# EAGLE design Tesla Camera PCB version 1 (EAGLE 6.5.0)
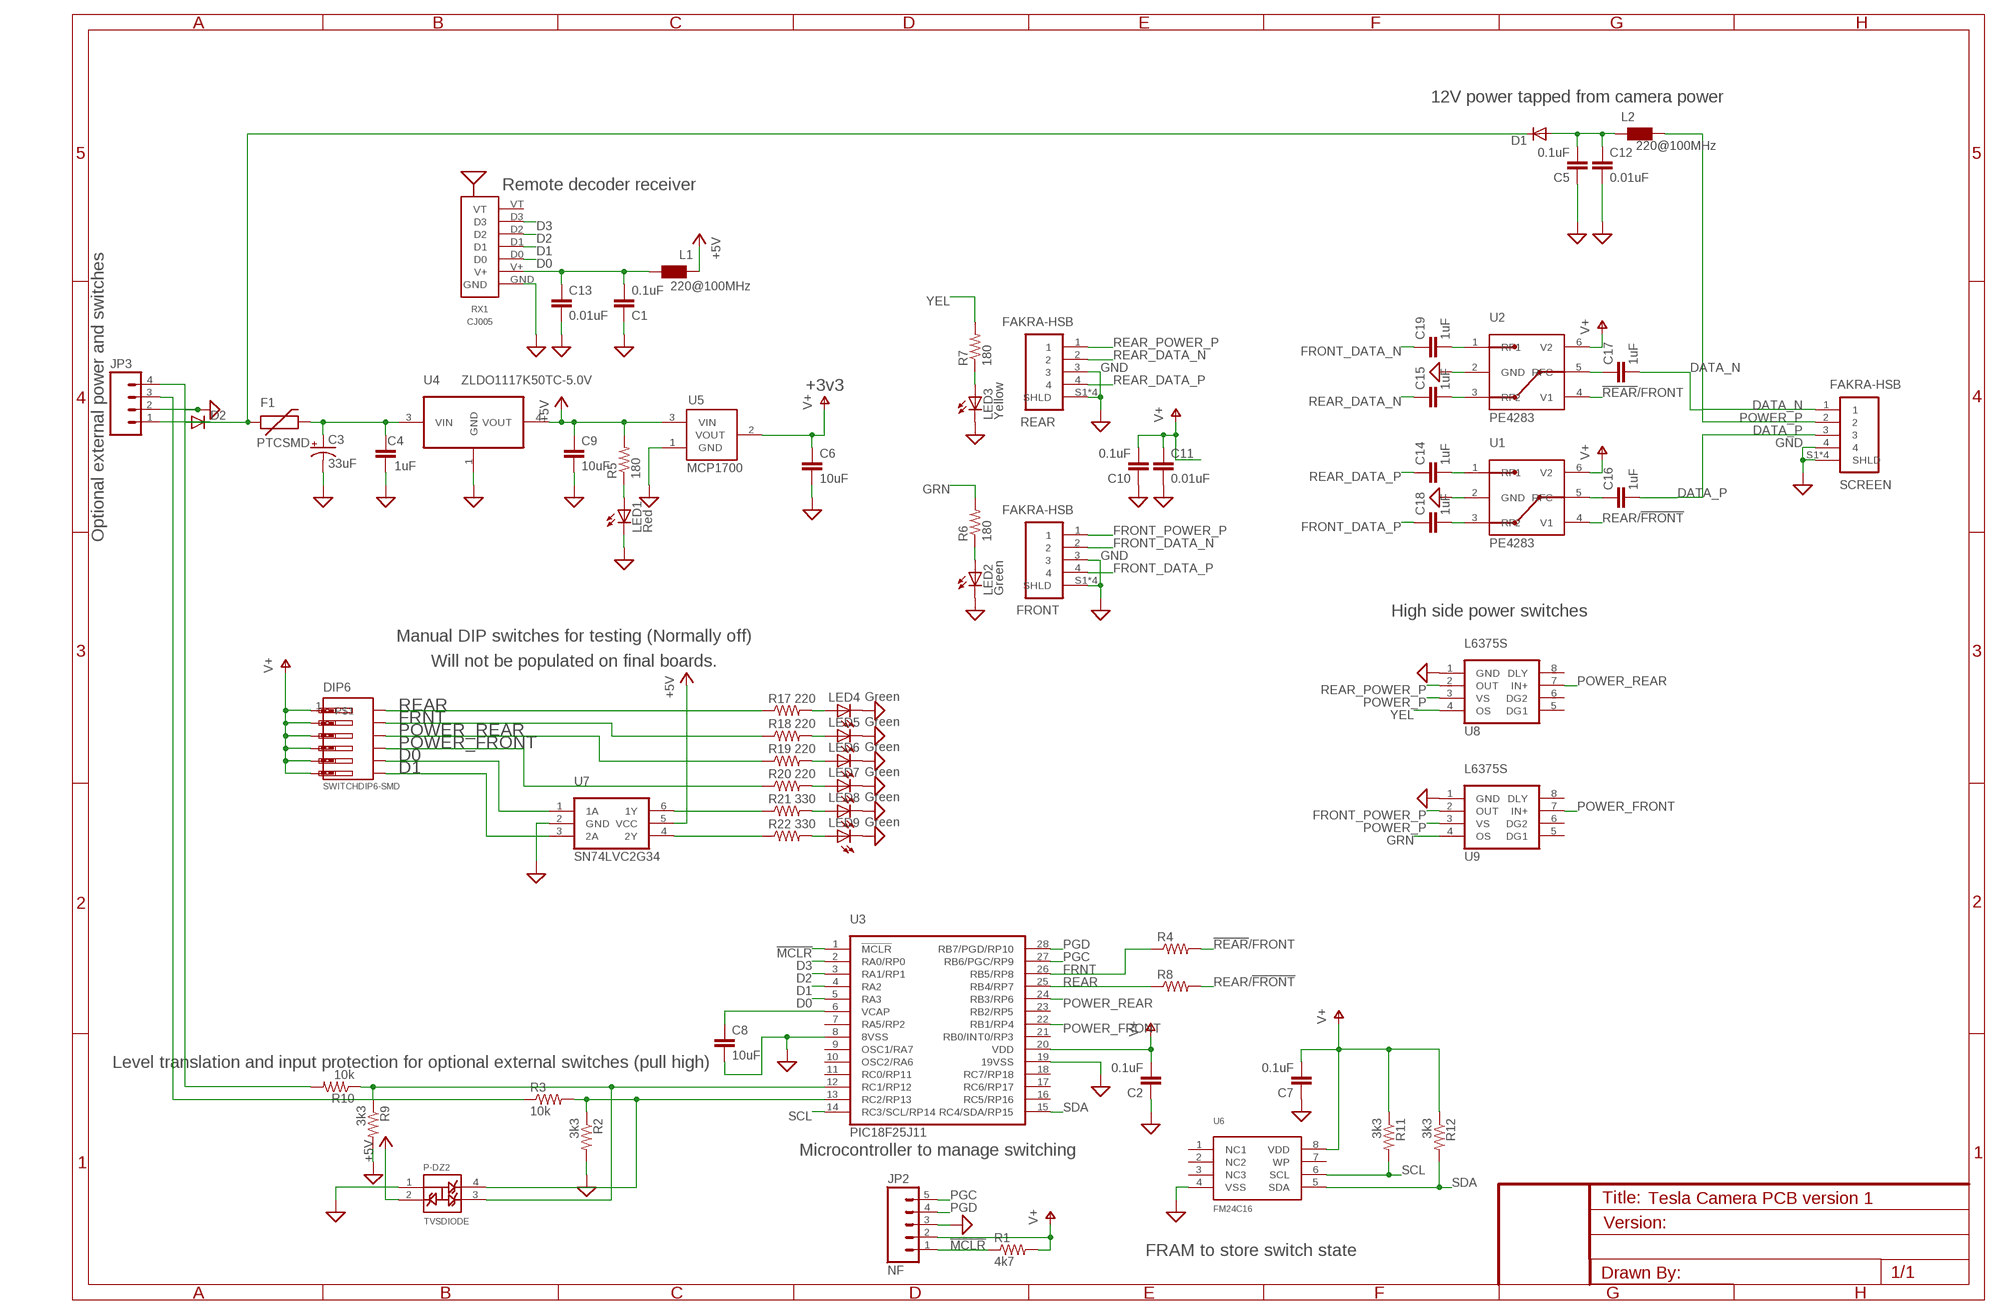
[diagram p0: schematic, sheet 1]

## Parts
C1  0.1uF  CAP0805  [0805]
C2  0.1uF  CAP0805  [0805]
C3  33uF  CAP_POLVTYPE  [CAPVTYPE]
C4  1uF  CAP0805  [0805]
C5  0.1uF  CAP0805  [0805]
C6  10uF  CAP0805  [0805]
C7  0.1uF  CAP0805  [0805]
C8  10uF  CAP0805  [0805]
C9  10uF  CAP0805  [0805]
C10  0.1uF  CAP0805  [0805]
C11  0.01uF  CAP0805  [0805]
C12  0.01uF  CAP0805  [0805]
C13  0.01uF  CAP0805  [0805]
C14  1uF  CAP0603-CAP  [0603-CAP]
C15  1uF  CAP0603-CAP  [0603-CAP]
C16  1uF  CAP0603-CAP  [0603-CAP]
C17  1uF  CAP0603-CAP  [0603-CAP]
C18  1uF  CAP0603-CAP  [0603-CAP]
C19  1uF  CAP0603-CAP  [0603-CAP]
D1  DIODE-DO-214AC  [DO-214AC]
D2  DIODE-DO-214AC  [DO-214AC]
DIP6  SWITCHDIP6-SMD  [SWITCHDIP6]
F1  PTCSMD  [PTC-1206]
FRONT  FAKRA-HSB  [FAKRA]
JP2  NF  M05LOCK  [1X05_LOCK]
JP3  M04-LOCK  [1X04_TERM_3.5MM]
L1  220@100MHz  WE-CBF_0805  [0805]
L2  220@100MHz  WE-CBF_0805  [0805]
LED1  Red  LEDLED  [0805_LED]
LED2  Green  LEDLED  [0805_LED]
LED3  Yellow  LEDLED  [0805_LED]
LED4  Green  LEDLED  [0805_LED]
LED5  Green  LEDLED  [0805_LED]
LED6  Green  LEDLED  [0805_LED]
LED7  Green  LEDLED  [0805_LED]
LED8  Green  LEDLED  [0805_LED]
LED9  Green  LEDLED  [0805_LED]
P-DZ2  TVSDIODE  [SOT143]
R1  4k7  RESISTOR  [0805]
R2  3k3  RESISTOR  [0805]
R3  10k  RESISTOR  [0805]
R4  RESISTOR  [0805]
R5  180  RESISTOR  [0805]
R6  180  RESISTOR  [0805]
R7  180  RESISTOR  [0805]
R8  RESISTOR  [0805]
R9  3k3  RESISTOR  [0805]
R10  10k  RESISTOR  [0805]
R11  3k3  RESISTOR  [0805]
R12  3k3  RESISTOR  [0805]
R17  220  RESISTOR  [0805]
R18  220  RESISTOR  [0805]
R19  220  RESISTOR  [0805]
R20  220  RESISTOR  [0805]
R21  330  RESISTOR  [0805]
R22  330  RESISTOR  [0805]
REAR  FAKRA-HSB  [FAKRA]
RX1  CJ005  [CJ005]
SCREEN  FAKRA-HSB  [FAKRA]
U1  PE4283  [SC70-6]
U2  PE4283  [SC70-6]
U3  PIC18F25J11  PIC18F46J11-SOIC  [SOIC-28-WIDE]
U4  ZLDO1117K50TC-5.0V  ZLDO1117K33TC-3.3V  [TO252]
U5  MCP1700  MCP1700SOT23-3  [SOT23-3]
U6  FM24C16  FM24C16-CYPRESS4.0X4.5MM  [TDFN-8-FRAM]
U7  SN74LVC2G34  [SOT23-6]
U8  L6375S  [SO08-EIAJ]
U9  L6375S  [SO08-EIAJ]

## Nets
!MCLR [Normal]: JP2.1 R1.1 U3.1(!MCLR)
!REAR!/FRONT: R4.2 U2.4(V1)
+5V: C9.1 L1.1 P-DZ2.2 R5.2 U4.4(VOUT) U5.3(VIN) U7.5(VCC)
D0 [Normal]: DIP6.8 RX1.D0 U3.5(RA3) U7.1(1A)
D1 [Normal]: DIP6.7 RX1.D1 U3.4(RA2) U7.3(2A)
D2 [Normal]: RX1.D2 U3.3(RA1/RP1)
D3 [Normal]: RX1.D3 U3.2(RA0/RP0)
DATA_N [Normal]: C17.2 SCREEN.1
DATA_P [Normal]: C16.2 SCREEN.3
FRNT [Normal]: DIP6.11 R4.1 R18.1 U3.26(RB5/RP8)
FRONT_DATA_N [Normal]: C19.1 FRONT.2
FRONT_DATA_P [Normal]: C18.1 FRONT.4
FRONT_POWER_P: FRONT.1 U9.2(OUT)
GND: C1.1 C2.1 C3.- C4.2 C5.1 C6.2 C7.1 C8.2 C9.2 C10.1 C11.2 C12.2 C13.2 FRONT.3 FRONT.S1(SHLD) FRONT.S2(SHLD) FRONT.S3(SHLD) FRONT.S4(SHLD) JP2.3 JP3.2 LED1.C LED2.C LED3.C LED4.C LED5.C LED6.C LED7.C LED8.C LED9.C P-DZ2.1 R2.2 R9.2 REAR.3 REAR.S1(SHLD) REAR.S2(SHLD) REAR.S3(SHLD) REAR.S4(SHLD) RX1.GND SCREEN.4 SCREEN.S1(SHLD) SCREEN.S2(SHLD) SCREEN.S3(SHLD) SCREEN.S4(SHLD) U1.2(GND) U2.2(GND) U3.8(8VSS) U3.19(19VSS) U4.1(GND) U5.1(GND) U6.4(VSS) U7.2(GND) U8.1(GND) U9.1(GND)
GRN [Normal]: R6.2 U9.4(OS)
N$1: C5.2 C12.1 D1.A L2.1
N$2 [Normal]: P-DZ2.3 R9.1 R10.1 U3.12(RC1/RP12)
N$3 [Normal]: LED2.A R6.1
N$4 [Normal]: JP3.3 R3.1
N$5 [Normal]: JP3.4 R10.2
N$7 [Normal]: C8.1 U3.6(VCAP)
N$8 [100ohm]: C19.2 U2.1(RF1)
N$9 [100ohm]: C15.2 U2.3(RF2)
N$10: D1.C D2.C F1.1
N$11 [100ohm]: C17.1 U2.5(RFC)
N$12: D2.A JP3.1
N$13 [100ohm]: C16.1 U1.5(RFC)
N$14 [Normal]: LED3.A R7.1
N$15: C3.+ C4.1 F1.2 U4.3(VIN)
N$16: LED1.A R5.1
N$17 [100ohm]: C18.2 U1.3(RF2)
N$18 [100ohm]: C14.2 U1.1(RF1)
N$19 [Normal]: LED4.A R17.2
N$20 [Normal]: LED5.A R18.2
N$21 [Normal]: LED6.A R19.2
N$22 [Normal]: LED7.A R20.2
N$23 [Normal]: LED8.A R21.2
N$24 [Normal]: LED9.A R22.2
N$25 [Normal]: R21.1 U7.6(1Y)
N$26 [Normal]: R22.1 U7.4(2Y)
N$27 [Normal]: P-DZ2.4 R2.1 R3.2 U3.13(RC2/RP13)
PGC [Normal]: JP2.5 U3.27(RB6/PGC/RP9)
PGD [Normal]: JP2.4 U3.28(RB7/PGD/RP10)
POWER_FRONT [Normal]: DIP6.9 R20.1 U3.22(RB1/RP4) U9.7(IN+)
POWER_P: L2.2 SCREEN.2 U8.3(VS) U9.3(VS)
POWER_REAR [Normal]: DIP6.10 R19.1 U3.24(RB3/RP6) U8.7(IN+)
REAR [Normal]: DIP6.12 R8.1 R17.1 U3.25(RB4/RP7)
REAR/!FRONT [Normal]: R8.2 U1.4(V1)
REAR_DATA_N [Normal]: C15.1 REAR.2
REAR_DATA_P [Normal]: C14.1 REAR.4
REAR_POWER_P: REAR.1 U8.2(OUT)
SCL [Normal]: R11.2 U3.14(RC3/SCL/RP14) U6.6(SCL)
SDA [Normal]: R12.2 U3.15(RC4/SDA/RP15) U6.5(SDA)
V+: C2.2 C6.1 C7.2 C10.2 C11.1 DIP6.1 DIP6.2 DIP6.3 DIP6.4 DIP6.5 DIP6.6 JP2.2 R1.2 R11.1 R12.1 U1.6(V2) U2.6(V2) U3.20(VDD) U5.2(VOUT) U6.8(VDD)
V+1: C1.2 C13.1 L1.2 RX1.V+
YEL [Normal]: R7.2 U8.4(OS)
Unconnected: RX1.VT U3.7(RA5/RP2) U3.9(OSC1/RA7) U3.10(OSC2/RA6) U3.11(RC0/RP11) U3.16(RC5/RP16) U3.17(RC6/RP17) U3.18(RC7/RP18) U3.21(RB0/INT0/RP3) U3.23(RB2/RP5) U6.1(NC1) U6.2(NC2) U6.3(NC3) U6.7(WP) U8.5(DG1) U8.6(DG2) U8.8(DLY) U9.5(DG1) U9.6(DG2) U9.8(DLY)

## Notes on the sheet
- 12V power tapped from camera power
- Remote decoder receiver
- +3v3
- Optional external power and switches
- High side power switches
- Manual DIP switches for testing (Normally off)
- Will not be populated on final boards.
- Level translation and input protection for optional external switches (pull high)
- Microcontroller to manage switching
- FRAM to store switch state

## Library data of the parts
C1 C5 C7 C10 = Mawrey:CAP: Capacitor Standard 0603 ceramic capacitor, and 0.1" leaded capacitor.; DESCRIPTION: CAP CER 0.1UF 50V 10% X7R 0805; EACH: 0.019; MFPN: 08055C104KAT2A; MFR: AVX CORPORATION (VA); VEND: Digi-Key; VPN: 478-1395-1-ND
C2 = ioBridge:CAP: Capacitor Standard 0603 ceramic capacitor, and 0.1" leaded capacitor.; DESCRIPTION: CAP CER 0.1UF 50V 10% X7R 0805; EACH: 0.019; MFPN: 08055C104KAT2A; MFR: AVX CORPORATION (VA); VEND: Digi-Key; VPN: 478-1395-1-ND
C3 = ioBridge:CAP_POL: Capacitor Polarized These are standard SMD and PTH capacitors. Normally 10uF, 47uF, and 100uF in electrolytic and tantalum varieties. Always verify the external diameter of the through hole cap, it varies with capacity, voltage, and manufacturer. The EIA devices should be standard.; DESCRIPTION: CAP ALUM 33UF 100V 20% SMD; EACH: 0.33428; MFPN: UUX2A330MNL1GS; MFR: Nichicon; NOTES: Alternative Panasonic EEE-HD1J330P; VEND: Digi-Key; VPN: 493-6281-1-ND
C4 = ioBridge:CAP: Capacitor Standard 0603 ceramic capacitor, and 0.1" leaded capacitor.; DESCRIPTION: CAP CER 1UF 50V Y5V 0805; EACH: 0.03; MFPN: CL21B105KBFNNNE; MFR: Samsung Electro-Mechanics America, Inc; VEND: Digi-Key; VPN: 1276-1029-1-ND
C6 C8 C9 = ioBridge:CAP: Capacitor Standard 0603 ceramic capacitor, and 0.1" leaded capacitor.; DESCRIPTION: CAP CER 10UF 10V Y5V 0805; EACH: 0.0522; MFPN: CC0805ZKY5V6BB106; MFR: Yageo; VEND: Digi-Key; VPN: 311-1355-1-ND
C11-C13 = ioBridge:CAP: Capacitor Standard 0603 ceramic capacitor, and 0.1" leaded capacitor.; DESCRIPTION: CAP CER 10000PF 50V 10% X7R 0805; EACH: 0.0154; MFPN: C0805C103K5RACTU; MFR: Kemet; VEND: Digi-Key; VPN: 399-1158-1-ND
C14-C19 = ioBridge:CAP: Capacitor Standard 0603 ceramic capacitor, and 0.1" leaded capacitor.; DESCRIPTION: CAP CER 1UF 50V 10% X5R 0603; EACH: 0.0523; MFPN: UMK107BJ105KA-T; MFR: Taiyo Yuden; VEND: Digi-Key; VPN: 587-2400-1-ND
D1 D2 = ioBridge:DIODE-: DIODE; MFPN: S1B-13-F; MFR: Diodes, Inc; VEND: DigiKey; VPN: S1B-FDITR-ND
DIP6 = ioBridge:SWITCHDIP6; DESCRIPTION: SWITCH DIP TOP SLIDE 6POS 24V; EACH: 1.63; MFPN: SDA06H1SBD; MFR: C&K Components; NOTES: Do not populate; VEND: DigiKey; VPN: CKN6080-ND
F1 = ioBridge:PTC: Resettable Fuse PTC Resettable Fuse. Spark Fun Electronics SKU : COM-08357; DESCRIPTION: PTC RESTTBLE 0.35A 16V CHIP 1206; EACH: 1.28; MFPN: 0ZCA0035FF2G; MFR: Bel Fuse Inc; VEND: Digi-Key; VPN: 507-1479-1-ND
FRONT REAR SCREEN = ioBridge:FAKRA-HSB; DESCRIPTION: Fakra Jack PCB mount Straight 4 Contact pin Connector for Blue GPS telematics or navigation; EACH: 2.73; VEND: RFSupplier.com; VPN: F03-SJPT4-C
JP2 = Mawrey:M05: Header 5 Standard 5-pin 0.1" header. Use with straight break away headers (SKU : PRT-00116), right angle break away headers (PRT-00553), swiss pins (PRT-00743), machine pins (PRT-00117), and female headers (PRT-00115). Molex polarized connector foot print use with SKU : PRT-08230 with associated crimp pins and housings.; NOTES: Do not populate
JP3 = ioBridge:M04: Header 4 Standard 4-pin 0.1" header. Use with straight break away headers (SKU : PRT-00116), right angle break away headers (PRT-00553), swiss pins (PRT-00743), machine pins (PRT-00117), and female headers (PRT-00115). Molex polarized connector foot print use with SKU : PRT-08231 with associated crimp pins and housings. 1MM SMD Version SKU: PRT-10208; DESCRIPTION: TERM BLOCK HEADER 4POS R/A 3.5MM; EACH: 0.865; MFPN: 284512-4; MFR: TE Connectivity; NOTES: Mates with A98375-ND; VEND: Digi-Key; VPN: A98398-ND
L1 L2 = ioBridge:WE-CBF: SMD EMI Suppression Ferrite Beads - excellent anti-EMI properties - low DCR - impedances till 3000 ohms - rated current up to 6 A; DESCRIPTION: FERRITE CHIP 220 OHM 1500MA 0805; EACH: 0.0223; MFPN: CIC21J221NE; MFR: Samsung Electro-Mechanics America, Inc; VEND: Digi-Key; VPN: 1276-6372-1-ND
LED1 = ioBridge:LED: LEDs Standard schematic elements and footprints for 5mm, 3mm, 1206, and 0603 sized LEDs. 5mm - Spark Fun Electronics SKU : COM-00529 (and others); DESCRIPTION: LED 2X1.2MM 640NM RD WTR CLR SMD; EACH: 0.1; MFPN: APT2012SRCPRV; MFR: Kingbright Corp; NOTES: Do not populate; VEND: Digi-Key; VPN: 754-1132-1-ND
LED2 LED4-LED8 = ioBridge:LED: LEDs Standard schematic elements and footprints for 5mm, 3mm, 1206, and 0603 sized LEDs. 5mm - Spark Fun Electronics SKU : COM-00529 (and others); DESCRIPTION: LED 2X1.2MM 570NM GN WTR CLR SMD; EACH: 0.11; MFPN: APT2012CGCK; MFR: Kingbright Corp; NOTES: Do not populate; VEND: Digi-Key; VPN: 754-1127-1-ND
LED3 = ioBridge:LED: LEDs Standard schematic elements and footprints for 5mm, 3mm, 1206, and 0603 sized LEDs. 5mm - Spark Fun Electronics SKU : COM-00529 (and others); DESCRIPTION: LED 2X1.2MM 588NM YW WTR CLR SMD; EACH: 0.08; MFPN: APT2012YC; MFR: Kingbright Corp; NOTES: Do not populate; VEND: Digi-Key; VPN: 754-1135-1-ND
LED9 = ioBridge:LED: LEDs Standard schematic elements and footprints for 5mm, 3mm, 1206, and 0603 sized LEDs. 5mm - Spark Fun Electronics SKU : COM-00529 (and others); DESCRIPTION: LED 2X1.2MM 570NM GN WTR CLR SMD; EACH: 0.1073; MFPN: APT2012CGCK; MFR: Kingbright Corp; NOTES: Do not populate; VEND: Digi-Key; VPN: 754-1127-1-ND
P-DZ2 = ioBridge:TVSDIODE; DESCRIPTION: TVS AVAL DIODE ARRAY 3 CH SOT143; EACH: 0.51548; MFPN: SP0503BAHTG; MFR: Littelfuse Inc; VEND: Digi-Key; VPN: F2715CT-ND
R1 = ioBridge:RESISTOR: Resistor Basic schematic elements and footprints for 0603, 1206, and PTH 1/10th watt (small) resistors.; DESCRIPTION: RES 4.70K OHM 1/8W 1% 0805 SMD; EACH: 0.006; MFPN: RC0805FR-074K7L; MFR: Yageo; VEND: Digi-Key; VPN: 311-4.70KCRCT-ND
R2 R9 R11 R12 = ioBridge:RESISTOR: Resistor Basic schematic elements and footprints for 0603, 1206, and PTH 1/10th watt (small) resistors.; DESCRIPTION: RES 3.3K OHM 1/8W 5% 0805 SMD; EACH: 0.0077; MFPN: RC0805JR-073K3L; MFR: Yageo; VEND: Digi-Key; VPN: 311-3.3KARCT-ND
R3 R10 = ioBridge:RESISTOR: Resistor Basic schematic elements and footprints for 0603, 1206, and PTH 1/10th watt (small) resistors.; DESCRIPTION: RES 10K OHM 1/8W 5% 0805 SMD; EACH: 0.007; MFPN: RC0805JR-0710KL; MFR: Yageo; VEND: Digi-Key; VPN: 311-10KARCT-ND
R4 R8 = ioBridge:RESISTOR: Resistor Basic schematic elements and footprints for 0603, 1206, and PTH 1/10th watt (small) resistors.; DESCRIPTION: RES 1.0K OHM 1/8W 5% 0805 SMD; EACH: 0.0077; MFPN: RC0805JR-071KL; MFR: Yageo; VEND: Digi-Key; VPN: 311-1.0KARCT-ND
R5-R7 = ioBridge:RESISTOR: Resistor Basic schematic elements and footprints for 0603, 1206, and PTH 1/10th watt (small) resistors.; DESCRIPTION: RES 180 OHM 1/8W 5% 0805 SMD; EACH: 0.0077; MFPN: RC0805JR-07180RL; MFR: Yageo; VEND: Digi-Key; VPN: 311-180ARCT-ND
R17-R20 = ioBridge:RESISTOR: Resistor Basic schematic elements and footprints for 0603, 1206, and PTH 1/10th watt (small) resistors.; DESCRIPTION: RES 220 OHM 1/8W 5% 0805 SMD; EACH: 0.0149; MFPN: ERJ-6GEYJ221V; MFR: Panasonic Electronic Components; VEND: Digi-Key; VPN: P220ACT-ND
R21 R22 = ioBridge:RESISTOR: Resistor Basic schematic elements and footprints for 0603, 1206, and PTH 1/10th watt (small) resistors.; DESCRIPTION: RES 330 OHM 1/8W 5% 0805; EACH: 0.0071; MFPN: RMCF0805JT330R; MFR: Stackpole Electronics Inc; VEND: Digi-Key; VPN: RMCF0805JT330RCT-ND
RX1 = ioBridge:CJ005: PT2262 remote control decoder - Canton Electronic; DESCRIPTION: Wireless Control 2 PCS 4 Way EV1527 Encoder Remotes & 1 PCS Super Regenerative Receivers 433MHZ; EACH: 19.15; MFPN: RT079; MFR: Canton Electronics; NOTES: Plus two remotes: http://www.canton-electronics.com/wireless-control-2-pcs-4-way-ev1527-encoder-remotes-1-pcs-super-regenerative-receivers-433mhz-p-224.html; VEND: Canton Electronics; VPN: RT079
U1 U2 = ioBridge:PE4283: SPDT High Power UltaCMOS DC-4.0 GHz RF Switch; DESCRIPTION: IC RF SWITCH SPDT 50 OHM SC70-6; EACH: 0.7127; MFPN: 4283-52; MFR: Peregrine Semiconductor; VEND: Digi-Key; VPN: 1046-1030-1-ND
U3 = ioBridge:PIC18F46J11; DESCRIPTION: IC MCU 8BIT 32KB FLASH 28SOIC; EACH: 2.08; MFPN: PIC18F25J11-I/SO; MFR: Microchip Technology; VEND: DigiKey; VPN: PIC18F25J11-I/SO-ND
U4 = ioBridge:ZLDO1117K33TC; DESCRIPTION: IC REG LDO 5V 1A TO252-3; EACH: 0.4017; MFPN: ZLDO1117K50TC; MFR: Diodes Incorporated; VEND: DigiKey; VPN: ZLDO1117K50DICT-ND
U5 = ioBridge:MCP1700: The MCP1700 is a CMOS low dropout positive voltage regulator which can source up to 250mA of current with an extremely low input-output voltage differential of 178mV at 250mA. The low dropout voltage combined with the low current consumption of only 1.6µA makes this part ideal for battery operation....; DESCRIPTION: IC REG LDO 3V 0.25A SOT23-3; EACH: 0.28; MFPN: MCP1700T-3002E/TT; MFR: Microchip Technology; VEND: DigiKey; VPN: MCP1700T-3002E/TTCT-ND
U6 = ioBridge:FM24C16-CYPRESS; DESCRIPTION: IC FRAM 16KBIT 1MHZ 8TDFN; EACH: 1.44; MFPN: FM24CL16B-DG; MFR: Cypress Semiconductor Corp; NOTES: New 4x4.5mm footprint; VEND: Digi-Key; VPN: FM24CL16B-DGRA-ND
U7 = ioBridge:SN74LVC2G34: Dual Buffer Gate. Digikey 296-13496-2-ND; DESCRIPTION: IC BUFFER DUAL NON-INV SOT23-6; EACH: 0.37; MFPN: SN74LVC2G34DBVR; MFR: Texas Instruments; NOTES: Do not populate; VEND: Digi-Key; VPN: 296-13496-1-ND
U8 U9 = ioBridge:L6375S: 0.5 A high-side driver intelligent power switch STMicro; DESCRIPTION: IC DRIVER HI SIDE 0.5A IPS SOIC8; EACH: 2.9688; MFPN: L6375STR; MFR: STMicroelectronics; VEND: Digi-Key; VPN: 497-6865-1-ND

## Net classes
0 Power: width 0.762 mm, drill 0.508 mm, clearance 0.254 mm
1 100ohm: width 2.794 mm, drill 0.508 mm, clearance 8.382 mm
2 Normal: width 0.254 mm, drill 0.508 mm, clearance 0.203 mm

## Board
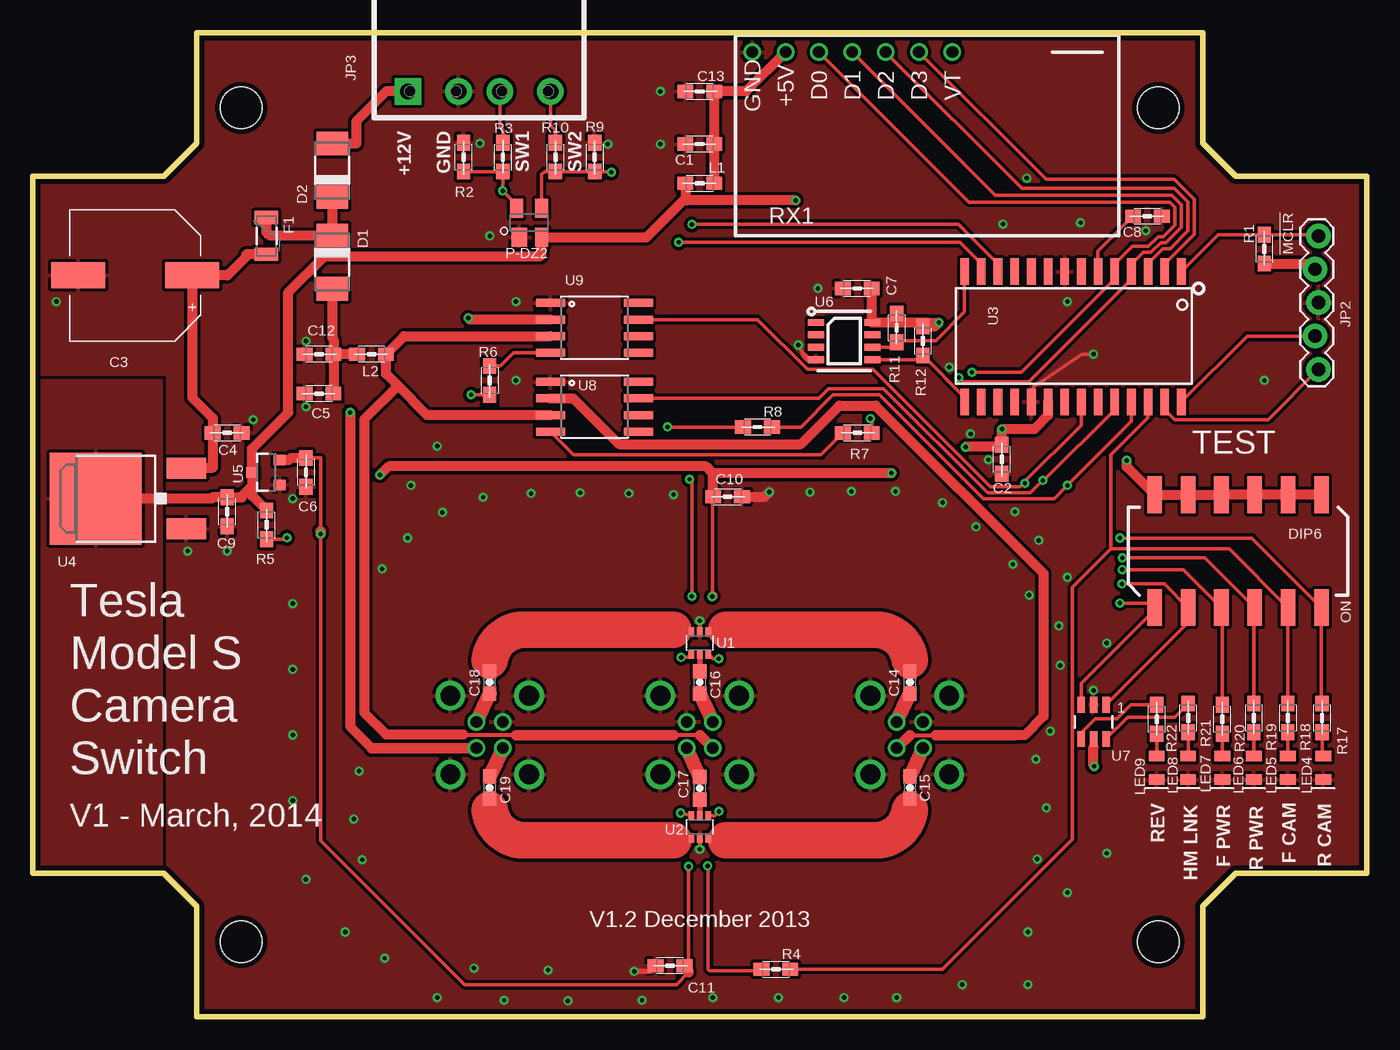
[diagram p1: board, top side]
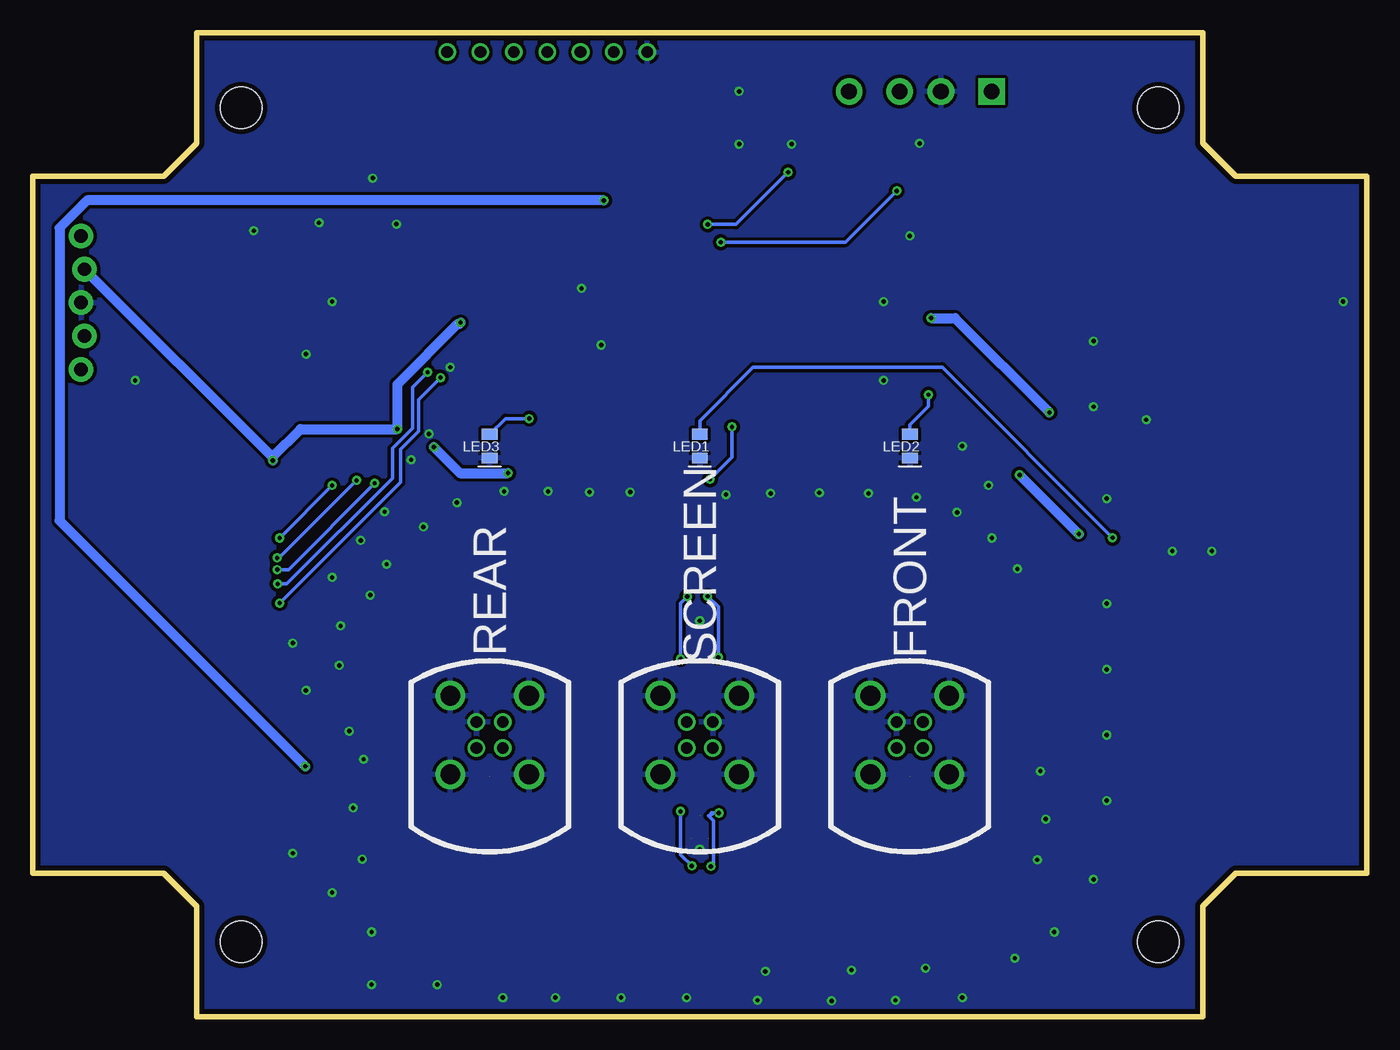
[diagram p2: board, bottom side, seen from below]

Size 101.6 x 74.93 mm. Coordinates in mm from the lower left corner, seen from the top.
Outline: 0,10.92 0,64.01 9.97,64.01 12.47,66.51 12.47,74.93 89.13,74.93 89.13,66.51 91.63,64.01 101.6,64.01 101.6,10.92 91.63,10.92 89.13,8.42 89.13,0 12.47,0 12.47,8.42 9.97,10.92 0,10.92
Copper layers (1*16): Top 0.0356mm / dielectric 14mil / Bottom 0.0356mm
Design rules "default": minimum track width 6mil, minimum drill 13mil, track to track 6mil, track to pad 6mil, pad to pad 6mil, via to via 6mil, smd to smd 6mil, copper to edge 15mil, drill to drill 6mil, minimum pad ring 7mil, minimum via ring 7mil, stop-mask expansion 3mil, vias tented up to drill 0mil, thermal gap 10mil
Holes 3.17 mm at 15.88,69.22 85.72,69.22 85.72,5.72 15.88,5.72

### Footprints (pad centres in the part's own frame; a part is rotated, then mirrored left to right if it is on the bottom)
0805 = smd 1.2 x 1: 1 -1.1,0; 2 1.1,0
CAPVTYPE = smd 2 x 4.1: + 0,-4.35; - 0,4.35
0603-CAP = smd 1.1 x 1: 1 -0.85,0; 2 0.85,0
DO-214AC = smd 1.8 x 2.4: A 2.025,0; C -2.025,0
SWITCHDIP6 = smd 1.118 x 2.794: 1 -6.35,-4.3; 2 -3.81,-4.3; 3 -1.27,-4.3; 4 1.27,-4.3; 5 3.81,-4.3; 6 6.35,-4.3; 7 6.35,4.3; 8 3.81,4.3; 9 1.27,4.3; 10 -1.27,4.3; 11 -3.81,4.3; 12 -6.35,4.3
PTC-1206 = smd 1 x 1.8: 1 -1.4,0; 2 1.4,0
FAKRA = drill 0.889 pad 1.27: 1 -1,-1; 2 -1,1; 3 1,1; 4 1,-1 | drill 1.511 pad 2.184: S1 -3,3; S2 3,3; S3 3,-3; S4 -3,-3
1X05_LOCK = drill 1.016 pad 1.88: 1 0,0.127; 2 2.54,-0.127; 3 5.08,0.127; 4 7.62,-0.127; 5 10.16,0.127
1X04_TERM_3.5MM = drill 1.2 pad 2.032 square: 1 -5.428,0 | drill 1.2 pad 2.032: 2 -1.572,0; 3 1.572,0; 4 5.428,0
0805_LED = smd 0.8 x 1.2: A 0.9,0; C -0.9,0
SOT143 = smd 1.2 x 1.44: 1 -0.75,-1.1 | smd 1 x 1.44: 2 0.95,-1.1; 3 0.95,1.1; 4 -0.95,1.1
CJ005 = drill 0.889: D0 -5.08,0; D1 -7.62,0; D2 -10.16,0; D3 -12.7,0; GND 0,0; V+ -2.54,0; VT -15.24,0
SC70-6 = smd 0.4 x 0.7: 1 -0.65,-0.85; 2 0,-0.85; 3 0.65,-0.85; 4 0.65,0.85; 5 0,0.85; 6 -0.65,0.85
SOIC-28-WIDE = smd 0.66 x 2.032: 1 -7.685,-3.285; 2 -6.415,-3.285; 3 -5.145,-3.285; 4 -3.875,-3.285; 5 -2.605,-3.285; 6 -1.335,-3.285; 7 -0.065,-3.285; 8 1.205,-3.285; 9 2.475,-3.285; 10 3.745,-3.285; 11 5.015,-3.285; 12 6.285,-3.285; 13 7.555,-3.285; 14 8.825,-3.285; 15 8.825,6.635; 16 7.555,6.635; 17 6.285,6.635; 18 5.015,6.635; 19 3.745,6.635; 20 2.475,6.635; 21 1.205,6.635; 22 -0.065,6.635; 23 -1.335,6.635; 24 -2.605,6.635; 25 -3.875,6.635; 26 -5.145,6.635; 27 -6.415,6.635; 28 -7.685,6.635
TO252 = smd 1.6 x 3: 1 -2.3,-6.9; 3 2.3,-6.9 | smd 7 x 7: 4 0,0
SOT23-3 = smd 0.8 x 0.9: 1 -0.95,-1; 2 0.95,-1; 3 0,1.1
TDFN-8-FRAM = smd 0.5 x 1.2: 1 -1.425,-2.15; 2 -0.475,-2.15; 3 0.475,-2.15; 4 1.425,-2.15; 5 1.425,2.15; 6 0.475,2.15; 7 -0.475,2.15; 8 -1.425,2.15
SOT23-6 = smd 0.55 x 1.2: 1 -0.95,-1.3; 2 0,-1.3; 3 0.95,-1.3; 4 0.95,1.3; 5 0,1.3; 6 -0.95,1.3
SO08-EIAJ = smd 0.61 x 2.21: 1 -1.905,-3.378; 2 -0.635,-3.378; 3 0.635,-3.378; 4 1.905,-3.378; 5 1.905,3.353; 6 0.635,3.353; 7 -0.635,3.353; 8 -1.905,3.353

### Placement (x,y rotation side)
C1  50.8,66.47 0 top
C2  73.8,42.47 90 top
C3  7.8,56.47 90 top
C4  14.8,44.47 0 top
C5  21.8,47.47 0 top
C6  20.8,41.47 270 top
C7  62.8,55.47 0 top
C8  84.9,60.97 0 top
C9  14.8,38.47 270 top
C10  52.92,39.6 180 top
C11  48.54,3.9 180 top
C12  21.8,50.47 180 top
C13  50.8,70.47 180 top
C14  66.8,25.47 90 top
C15  66.8,17.47 270 top
C16  50.8,25.47 270 top
C17  50.8,17.42 90 top
C18  34.8,25.47 90 top
C19  34.8,17.47 270 top
D1  22.8,57.47 270 top
D2  22.8,64.47 90 top
DIP6  91.8,35.47 180 top
F1  17.8,59.47 270 top
FRONT  34.8,21.47 90 bottom
JP2  97.8,59.47 270 top
JP3  34,70.47 0 top
L1  50.8,63.47 0 top
L2  25.8,50.47 0 top
LED1  50.8,43.47 90 bottom
LED2  34.8,43.46 90 bottom
LED3  66.8,43.47 90 bottom
LED4  98.3,18.97 90 top
LED5  95.6,18.97 90 top
LED6  93,18.97 90 top
LED7  90.6,18.97 90 top
LED8  88,18.97 90 top
LED9  85.6,18.97 90 top
P-DZ2  37.8,60.47 0 top
R1  93.8,58.47 270 top
R2  32.8,65.47 90 top
R3  35.8,65.47 270 top
R4  56.6,3.61 180 top
R5  17.8,37.47 90 top
R6  34.8,48.47 90 top
R7  62.8,44.47 180 top
R8  55.2,44.91 180 top
R9  42.8,65.47 90 top
R10  39.8,65.47 90 top
R11  65.8,52.47 270 top
R12  67.8,51.47 270 top
R17  98.2,22.77 270 top
R18  95.6,22.77 270 top
R19  93,22.77 270 top
R20  90.6,22.67 270 top
R21  88,22.77 270 top
R22  85.6,22.67 270 top
REAR  66.8,21.47 90 bottom
RX1  54.8,73.47 180 top
SCREEN  50.8,21.47 90 bottom
U1  50.8,28.47 180 top
U2  50.8,14.47 0 top
U3  79.8,53.47 180 top
U4  4.8,39.47 90 top
U5  17.8,41.47 90 top
U6  61.8,51.47 270 top
U7  80.8,22.47 180 top
U8  42.8,46.47 270 top
U9  42.8,52.47 270 top

### Tracks (layer width: path | path; a pad name or v marks a point on that pad's centre or on a via)
!MCLR
  Top 0.254: U3.1 90.3,59.57 R1.1 97.83,59.57 JP2.1
!REAR!/FRONT  (via drill 0.33 pad 0.69)
  Top 0.254: v51.4,11.49 51.43,11.46 51.43,3.63 51.52,3.53 55.41,3.53 R4.2 | U2.4 51.93,15.32 v52.27,15.65
  Bottom 0.254: v51.4,11.49 52.27,12.36 v52.27,15.65
+5V  (via drill 0.33 pad 0.69)
  Top 0.55: 80.79,20.56 80.8,20.57 U7.5
  Top 0.762: U4.4 13.65,39.47 13.65,39.55 13.66,39.57 C9.1 15.93,39.57 15.93,39.67 16.7,40.43 | 16.7,40.43 16.7,39.67 R5.2 | 16.7,40.43 U5.3 16.7,43.26 19.45,46.02 19.45,55.16 22.22,57.93 38.67,57.93 38.75,58.01 P-DZ2.2 46.73,59.37 49.7,62.33 | L1.1 49.7,62.33 | v58.1,62.17 49.86,62.17 49.7,62.33 | v80.85,19.08 80.79,19.14 80.79,20.56
  Bottom 0.762: v58.1,62.17 97.47,62.17 99.56,60.07 99.56,37.8 v80.85,19.08
  pour Top (rank 2): -0.2,10.47 9.8,10.47 9.8,48.47 -0.2,48.47
D0  (via drill 0.33 pad 0.69)
  Top 0.254: v71.53,49.09 75.3,49.09 82.41,56.19 U3.5 82.41,57.34 83.75,58.68 84.98,58.68 85.71,59.42 86.12,59.42 86.99,60.29 86.99,61.65 86.61,62.04 71.31,62.04 RX1.D0 | v82.95,32.98 86.18,32.98 DIP6.8 87.99,30.01 U7.1 | v82.95,32.98
  Bottom 0.254: v82.95,32.98 82.26,32.98 74.2,41.03 74.2,43.29 72.67,44.83 72.67,47.95 v71.53,49.09
D1  (via drill 0.33 pad 0.69)
  Top 0.254: v70.54,48.67 70.85,48.36 75.87,48.36 83.67,56.17 U3.4 83.67,57.3 84.6,58.23 85.17,58.23 85.9,58.96 86.31,58.96 87.49,60.14 87.49,61.83 86.77,62.55 73.33,62.55 RX1.D1 | v82.8,31.52 85.1,31.52 DIP6.7 85.45,31.02 79.85,25.42 U7.3
  Bottom 0.254: v82.8,31.52 73.6,40.71 73.6,43.2 72.21,44.6 72.21,47.01 v70.54,48.67
D2
  Top 0.254: U3.3 84.94,57.35 86.09,58.5 86.63,58.5 87.97,59.84 87.97,62.06 86.95,63.09 75.34,63.09 RX1.D2
D3
  Top 0.254: U3.2 86.22,57.36 88.46,59.6 88.46,62.27 86.95,63.77 77.19,63.77 RX1.D3
DATA_N
  Top 1.05: SCREEN.1 C17.2
DATA_P
  Top 1.05: SCREEN.3 C16.2
FRNT
  Top 0.254: 82.12,35.63 79.2,32.7 79.2,13.52 69.3,3.62 R4.1 | R4.1 | U3.26 84.94,45.61 82.12,42.79 82.12,35.63 | 82.12,35.63 91.15,35.63 DIP6.11 R18.1 | R4.1 57.7,3.57 57.8,3.47
FRONT_DATA_N  (1 unrouted)
  Top 1.05: FRONT.2 C19.1
FRONT_DATA_P
  Top 1.05: FRONT.4 C18.1
FRONT_POWER_P  (via drill 0.33 pad 0.69)
  Top 0.762: U9.2 33.29,53.1 v33.18,53.21 | v24.17,46.02 24.17,22.1 25.8,20.47
  Top 0.813: FRONT.1 25.8,20.47
  Bottom 0.762: v33.18,53.21 31.36,53.21 v24.17,46.02
GND  (via drill 0.33 pad 0.69)
  Top 0.254: 58.7,50.42 v58.3,51.16 | U3.19 76.25,47.97 79.9,50.47 v80.8,50.47
  Top 0.305: v50.8,30.17 U1.2 | U2.2 v50.8,12.77
  Top 0.406: U6.4 59.07,50.04 58.7,50.42 | v45.8,3.47 47,3.47 C11.2
  Top 0.762: C10.1 55.73,39.6 v56.1,39.97
  other vias: 39.25,3.57 46.4,1.27 40.75,1.22 35.9,1.27 77.5,21.77 78.25,26.77 78.15,29.77 78.8,33.47 74.8,38.47 76.62,36.28 81.8,12.47 78.8,9.47 75.8,6.47 70.8,2.47 65.8,1.47 61.8,1.47 56.8,1.47 51.8,1.47 30.8,1.47 26.8,4.47 23.8,6.47 20.8,10.47 19.8,31.47 19.8,26.47 19.8,21.47 19.8,16.47 24.85,18.72 24.45,15.07 25.1,11.97 33.6,3.72 76.5,12.02 76.4,19.62 75.9,32.12 74.65,34.47 71.85,37.32 69.3,39.17 65.7,40.02 62.35,40.02 59.2,39.97 48.8,39.77 45.4,39.87 41.7,39.92 37.95,39.87 34.3,39.57 31.2,38.42 28.55,36.47 26.6,34.12 81.8,28.47 28.8,40.47 30.8,43.47 77.2,15.92 75.8,2.47 80.8,24.87 79.8,60.47 78.8,54.47 84.77,59.86 71.43,44.4 72.79,42.43 11.8,35.47 14.8,35.47 19.8,39.47 16.8,45.47 1.8,54.47 59.8,55.47 47.8,66.47 47.8,70.47 43.8,66.47 34.05,66.52 34.8,59.47 20.8,51.47 20.8,46.47 73.9,60.37 75.7,63.87 69.8,49.47 36.8,54.47 36.8,48.47 93.8,48.47
  pour Top (rank 3): -6.2,-5.53 106.8,-5.53 106.8,79.47 -6.2,79.47
  pour Bottom: -2.2,-1.53 103.8,-1.53 103.8,76.47 -2.2,76.47
GRN
  Top 0.254: R6.2 35.63,49.57 36.62,50.56 U9.4
N$1
  Top 0.762: L2.1 C12.1 | C12.1 C5.2 | D1.A 22.8,51.7 22.9,51.6 C12.1
N$2  (via drill 0.33 pad 0.69)
  Top 0.254: U3.12 73.52,57.34 70.51,60.34 v50.2,60.34 | P-DZ2.3 38.75,64.15 38.97,64.37 R10.1 R9.1 44.02,64.37 v44.06,64.32
  Bottom 0.254: v44.06,64.32 48.04,60.34 v50.2,60.34
N$3  (via drill 0.33 pad 0.69)
  Top 0.254: v33.38,47.38 33.96,47.38 33.97,47.37 R6.1
  Bottom 0.254: LED2.A 34.8,45.1 33.38,46.52 v33.38,47.38
N$4
  Top 0.254: JP3.3 35.57,67.72 35.8,67.5 R3.1
N$5
  Top 0.254: JP3.4 39.43,67.87 39.8,67.5 R10.2
N$7
  Top 0.254: U3.6 81.13,58.3 C8.1
N$8  (1 unrouted)
  Top 0.305: U2.1 48.95,13.62 48.91,13.61 48.88,13.6 48.84,13.57 48.82,13.54 48.8,13.5 48.8,13.47
  Top 0.762: 34.8,15.77 C19.2
  Top 2.794: 34.8,15.77 34.8,15.73 34.81,15.7 34.82,15.66 34.82,15.63 34.83,15.59 34.84,15.56 34.84,15.52 34.85,15.49 34.86,15.46 34.87,15.42 34.88,15.39 34.89,15.36 34.9,15.32 34.91,15.29 34.92,15.26 34.93,15.22 34.94,15.19 34.95,15.16 34.97,15.12 34.98,15.09 34.99,15.06 35.01,15.03 35.02,15 35.04,14.96 35.05,14.93 35.07,14.9 35.08,14.87 35.1,14.84 35.12,14.81 35.14,14.78 35.15,14.75 35.17,14.72 35.19,14.69 35.21,14.66 35.23,14.63 35.25,14.6 35.27,14.57 35.29,14.54 35.31,14.52 35.33,14.49 35.35,14.46 35.37,14.43 35.4,14.41 35.42,14.38 35.44,14.35 35.46,14.33 35.49,14.3 35.51,14.27 35.54,14.25 35.56,14.22 35.59,14.2 35.61,14.18 35.64,14.15 35.66,14.13 35.69,14.11 35.71,14.08 35.74,14.06 35.77,14.04 35.8,14.02 35.82,13.99 35.85,13.97 35.88,13.95 35.91,13.93 35.94,13.91 35.97,13.89 35.99,13.87 36.02,13.85 36.05,13.84 36.08,13.82 36.11,13.8 36.14,13.78 36.18,13.77 36.21,13.75 36.24,13.73 36.27,13.72 36.3,13.7 36.33,13.69 36.36,13.67 36.4,13.66 36.43,13.65 36.46,13.63 36.49,13.62 36.53,13.61 36.56,13.6 36.59,13.58 36.62,13.57 36.66,13.56 36.69,13.55 36.72,13.54 36.76,13.53 36.79,13.52 36.83,13.52 36.86,13.51 36.89,13.5 36.93,13.49 36.96,13.49 37,13.48 37.03,13.48 37.07,13.47 37.1,13.47 37.14,13.46 37.17,13.46 37.21,13.45 37.24,13.45 37.28,13.45 37.31,13.45 37.35,13.44 37.38,13.44 37.42,13.44 37.45,13.44 37.49,13.44 37.52,13.44 37.56,13.44 37.59,13.45 37.63,13.45 37.66,13.45 37.7,13.45 37.73,13.46 37.77,13.46 37.8,13.47 48.8,13.47
N$9  (1 unrouted)
  Top 0.305: U2.3 51.64,13.47 52.8,13.47 | 66.8,15.77 C15.2
  Top 2.794: 52.8,13.47 63.8,13.47 63.83,13.46 63.87,13.46 63.9,13.45 63.94,13.45 63.97,13.45 64.01,13.45 64.04,13.44 64.08,13.44 64.11,13.44 64.15,13.44 64.18,13.44 64.22,13.44 64.25,13.44 64.29,13.45 64.32,13.45 64.36,13.45 64.39,13.45 64.43,13.46 64.46,13.46 64.5,13.47 64.53,13.47 64.57,13.48 64.6,13.48 64.64,13.49 64.67,13.49 64.7,13.5 64.74,13.51 64.77,13.52 64.81,13.52 64.84,13.53 64.88,13.54 64.91,13.55 64.94,13.56 64.97,13.57 65.01,13.58 65.04,13.6 65.07,13.61 65.11,13.62 65.14,13.63 65.17,13.65 65.2,13.66 65.24,13.67 65.27,13.69 65.3,13.7 65.33,13.72 65.36,13.73 65.39,13.75 65.42,13.77 65.45,13.78 65.48,13.8 65.52,13.82 65.55,13.84 65.58,13.85 65.6,13.87 65.63,13.89 65.66,13.91 65.69,13.93 65.72,13.95 65.75,13.97 65.78,13.99 65.8,14.02 65.83,14.04 65.86,14.06 65.88,14.08 65.91,14.11 65.94,14.13 65.96,14.15 65.99,14.18 66.01,14.2 66.04,14.22 66.06,14.25 66.09,14.27 66.11,14.3 66.14,14.33 66.16,14.35 66.18,14.38 66.2,14.41 66.23,14.43 66.25,14.46 66.27,14.49 66.29,14.52 66.31,14.54 66.33,14.57 66.35,14.6 66.37,14.63 66.39,14.66 66.41,14.69 66.43,14.72 66.45,14.75 66.46,14.78 66.48,14.81 66.5,14.84 66.52,14.87 66.53,14.9 66.55,14.93 66.56,14.96 66.58,15 66.59,15.03 66.61,15.06 66.62,15.09 66.63,15.12 66.64,15.16 66.66,15.19 66.67,15.22 66.68,15.26 66.69,15.29 66.7,15.32 66.71,15.36 66.72,15.39 66.73,15.42 66.74,15.46 66.75,15.49 66.76,15.52 66.76,15.56 66.77,15.59 66.78,15.63 66.78,15.66 66.79,15.7 66.8,15.73 66.8,15.77
N$10
  Top 0.762: F1.1 17.8,59.73 18.04,59.49 D1.C D2.C
N$11  (1 unrouted)
  Top 0.406: C17.1 50.8,16.47 U2.5
N$12
  Top 0.762: JP3.1 26.92,70.47 24.63,68.18 24.63,66.49 D2.A
N$13
  Top 0.406: U1.5 C16.1
N$14  (via drill 0.33 pad 0.69)
  Top 0.254: R7.1 63.9,45.45 v63.79,45.56
  Bottom 0.254: LED3.A 65.61,45.56 v63.79,45.56
N$15
  Top 0.762: U4.3 13.65,41.78 13.7,41.83 C4.1 13.7,45.6 12.15,47.15 C3.+ 14.83,56.47 16.27,57.9 16.27,58.07 F1.2
N$16  (via drill 0.33 pad 0.69)
  Top 0.254: R5.1 19.23,36.37 v19.35,36.49
  Bottom 0.254: LED1.A 50.8,45.4 46.73,49.47 32.33,49.47 v19.35,36.49
N$17
  Top 0.305: 48.8,29.47 48.8,29.43 48.82,29.39 48.84,29.36 48.88,29.34 48.91,29.32 48.95,29.32 U1.3 | C18.2 34.8,27.17
  Top 2.794: 48.8,29.47 37.8,29.47 37.77,29.47 37.73,29.47 37.7,29.48 37.66,29.48 37.63,29.48 37.59,29.48 37.56,29.49 37.52,29.49 37.49,29.49 37.45,29.49 37.42,29.49 37.38,29.49 37.35,29.49 37.31,29.48 37.28,29.48 37.24,29.48 37.21,29.48 37.17,29.47 37.14,29.47 37.1,29.47 37.07,29.46 37.03,29.46 37,29.45 36.96,29.44 36.93,29.44 36.89,29.43 36.86,29.42 36.83,29.41 36.79,29.41 36.76,29.4 36.72,29.39 36.69,29.38 36.66,29.37 36.62,29.36 36.59,29.35 36.56,29.34 36.53,29.32 36.49,29.31 36.46,29.3 36.43,29.29 36.4,29.27 36.36,29.26 36.33,29.24 36.3,29.23 36.27,29.21 36.24,29.2 36.21,29.18 36.18,29.17 36.14,29.15 36.11,29.13 36.08,29.11 36.05,29.1 36.02,29.08 35.99,29.06 35.97,29.04 35.94,29.02 35.91,29 35.88,28.98 35.85,28.96 35.82,28.94 35.8,28.92 35.77,28.89 35.74,28.87 35.71,28.85 35.69,28.83 35.66,28.8 35.64,28.78 35.61,28.76 35.59,28.73 35.56,28.71 35.54,28.68 35.51,28.66 35.49,28.63 35.46,28.6 35.44,28.58 35.42,28.55 35.4,28.53 35.37,28.5 35.35,28.47 35.33,28.44 35.31,28.42 35.29,28.39 35.27,28.36 35.25,28.33 35.23,28.3 35.21,28.27 35.19,28.24 35.17,28.21 35.15,28.18 35.14,28.15 35.12,28.12 35.1,28.09 35.08,28.06 35.07,28.03 35.05,28 35.04,27.97 35.02,27.94 35.01,27.9 34.99,27.87 34.98,27.84 34.97,27.81 34.95,27.77 34.94,27.74 34.93,27.71 34.92,27.68 34.91,27.64 34.9,27.61 34.89,27.58 34.88,27.54 34.87,27.51 34.86,27.47 34.85,27.44 34.84,27.41 34.84,27.37 34.83,27.34 34.82,27.3 34.82,27.27 34.81,27.23 34.8,27.2 34.8,27.17
N$18
  Top 0.305: 66.8,27.17 C14.2 | 52.8,29.47 51.6,29.47 51.56,29.46 51.52,29.45 51.49,29.42 51.47,29.39 51.45,29.35 U1.1
  Top 2.794: 66.8,27.17 66.8,27.2 66.79,27.23 66.78,27.27 66.78,27.3 66.77,27.34 66.76,27.37 66.76,27.41 66.75,27.44 66.74,27.47 66.73,27.51 66.72,27.54 66.71,27.58 66.7,27.61 66.69,27.64 66.68,27.68 66.67,27.71 66.66,27.74 66.64,27.77 66.63,27.81 66.62,27.84 66.61,27.87 66.59,27.9 66.58,27.94 66.56,27.97 66.55,28 66.53,28.03 66.52,28.06 66.5,28.09 66.48,28.12 66.46,28.15 66.45,28.18 66.43,28.21 66.41,28.24 66.39,28.27 66.37,28.3 66.35,28.33 66.33,28.36 66.31,28.39 66.29,28.42 66.27,28.44 66.25,28.47 66.23,28.5 66.2,28.53 66.18,28.55 66.16,28.58 66.14,28.6 66.11,28.63 66.09,28.66 66.06,28.68 66.04,28.71 66.01,28.73 65.99,28.76 65.96,28.78 65.94,28.8 65.91,28.83 65.88,28.85 65.86,28.87 65.83,28.89 65.8,28.92 65.78,28.94 65.75,28.96 65.72,28.98 65.69,29 65.66,29.02 65.63,29.04 65.6,29.06 65.58,29.08 65.55,29.1 65.52,29.11 65.48,29.13 65.45,29.15 65.42,29.17 65.39,29.18 65.36,29.2 65.33,29.21 65.3,29.23 65.27,29.24 65.24,29.26 65.2,29.27 65.17,29.29 65.14,29.3 65.11,29.31 65.07,29.32 65.04,29.34 65.01,29.35 64.97,29.36 64.94,29.37 64.91,29.38 64.88,29.39 64.84,29.4 64.81,29.41 64.77,29.41 64.74,29.42 64.7,29.43 64.67,29.44 64.64,29.44 64.6,29.45 64.57,29.46 64.53,29.46 64.5,29.47 64.46,29.47 64.43,29.47 64.39,29.48 64.36,29.48 64.32,29.48 64.29,29.48 64.25,29.49 64.22,29.49 64.18,29.49 64.15,29.49 64.11,29.49 64.08,29.49 64.04,29.49 64.01,29.48 63.97,29.48 63.94,29.48 63.9,29.48 63.87,29.47 63.83,29.47 63.8,29.47 52.8,29.47
N$19
  Top 0.254: R17.2 98.2,19.97 LED4.A
N$20
  Top 0.254: R18.2 LED5.A
N$21
  Top 0.254: R19.2 LED6.A
N$22
  Top 0.254: R20.2 LED7.A
N$23
  Top 0.254: R21.2 LED8.A
N$24
  Top 0.254: R22.2 LED9.A
N$25
  Top 0.254: U7.6 83.42,22.83 86.97,22.83 R21.1
N$26
  Top 0.254: U7.4 79.85,21.63 80.94,22.72 82.57,22.72 83.62,23.77 R22.1
N$27  (via drill 0.33 pad 0.69)
  Top 0.254: P-DZ2.4 36.85,61.84 v35.8,62.89 35.8,63.38 R3.2 R2.1 | v49.19,58.99 70.62,58.99 72.25,57.36 U3.13
  Bottom 0.254: v49.19,58.99 39.7,58.99 v35.8,62.89
PGC
  Top 0.254: JP2.5 94.11,45.48 86.97,45.48 86.22,46.24 U3.27
PGD
  Top 0.254: U3.28 92.5,51.85 JP2.4
POWER_FRONT  (via drill 0.33 pad 0.69)
  Top 0.254: 75.46,40.65 75.48,40.63 v75.56,40.63 | v82.98,34.07 87.63,34.07 DIP6.9 90.6,31.1 R20.1 | U3.22 79.86,45.06 75.46,40.65 | 75.46,40.65 75.17,40.36 72.93,40.36 63.99,49.3 58.99,49.3 55.19,53.1 U9.7
  Bottom 0.254: v82.98,34.07 82.12,34.07 v75.56,40.63
POWER_P
  Top 0.254: 32.79,21.52 32.8,21.47
  Top 0.305: 50.8,21.47 48.8,21.47 | 36.8,21.47 32.8,21.47
  Top 0.762: U9.3 28.26,51.83 L2.2 26.9,48.96 27.81,48.05 | 27.81,48.05 25.25,45.49 25.25,23.28 | 25.25,23.28 | 25.25,23.28 25.25,23.17 26.9,21.52 32.79,21.52 | U8.3 30.03,45.83 27.81,48.05
  Top 0.813: SCREEN.2 50.8,21.47 | 48.8,21.47 36.8,21.47
POWER_REAR  (via drill 0.33 pad 0.69)
  Top 0.254: v82.99,34.96 89.28,34.96 DIP6.10 93,31.1 R19.1 | U3.24 82.41,46.24 77.02,40.86 v76.93,40.86 75.98,39.9 72.75,39.9 64.8,47.84 60.62,47.84 59.88,47.1 U8.7
  Bottom 0.254: v82.99,34.96 82.83,34.96 v76.93,40.86
REAR  (via drill 0.33 pad 0.69)
  Top 0.254: v82.8,36.47 92.85,36.47 DIP6.12 98.15,23.92 R17.1 | R8.1 58.5,44.92 60.95,47.37 64.5,47.37 72.4,39.47 77.8,39.47 v78.8,40.47 83.67,45.34 U3.25
  Bottom 0.254: v82.8,36.47 v78.8,40.47
REAR/!FRONT  (via drill 0.33 pad 0.69)
  Top 0.254: v48.35,44.93 v48.36,44.92 R8.2 | v50.02,40.93 50.21,40.75 50.21,32.05 v50.19,32.03 | U1.4 49.9,27.37 v49.38,27.37
  Bottom 0.254: v50.02,40.93 48.35,42.61 v48.35,44.93 | v50.19,32.03 49.38,31.22 v49.38,27.37
REAR_DATA_N  (1 unrouted)
  Top 1.05: REAR.2 C15.1
REAR_DATA_P
  Top 1.05: REAR.4 C14.1
REAR_POWER_P
  Top 0.305: 66.8,21.47 68.8,21.47
  Top 0.762: U8.2 41.16,47.1 44.66,43.61 58.49,43.61 61.43,46.54 64.2,46.54 76.98,33.76 76.98,22.89 75.55,21.47 74.8,21.47
  Top 0.813: REAR.1 66.8,21.47 | 68.8,21.47 74.8,21.47
SCL
  Top 0.254: U3.14 70.97,53.68 68.78,51.48 66.36,51.48 65.88,50.99 U6.6 65.42,50.99 R11.2
SDA
  Top 0.254: U3.15 70.97,47.19 R12.2 67.47,50.04 U6.5
V+  (via drill 0.33 pad 0.69)  (1 unrouted)
  Top 0.254: 21.93,36.78 21.93,13.42 32.89,2.46 49.02,2.46 49.96,3.4 | v49.96,11.46 49.96,3.51 49.89,3.51 C11.1 | C6.1 21.93,42.57 21.93,37 | 51.79,32.04 51.79,39.6 C10.2 | v49.35,15.53 U2.6 | v52.26,27.28 51.82,27.28 51.65,27.45 51.62,27.45 51.52,27.55
  Top 0.762: 65.8,52.89 68.09,52.89 v69.02,52.87 68.71,52.57 R12.1 | 65.8,52.89 U6.8 63.9,52.94 C7.2 | 65.8,52.89 R11.1 | 49.96,3.4 49.96,3.51 | v21.92,36.78 21.93,36.78 21.93,37 21.9,37 | 51.79,41.41 51.27,41.92 27.1,41.92 v26.44,41.26 | 51.79,32.04 v51.75,32 | 51.79,41.41 51.79,39.6 | v65.41,41.41 51.79,41.41 | v83.32,42.37 83.32,41.89 DIP6.6 DIP6.5 DIP6.4 DIP6.3 DIP6.2 DIP6.1 | U5.2 19.51,42.42 19.66,42.57 C6.1 | U3.20 77.32,45.8 76.29,44.76 v73.83,44.76 73.8,44.73 C2.2 73.65,43.42 71.08,43.42 v71.05,43.38 | R1.2 97.23,57.37 JP2.2
  Bottom 0.254: 50.1,15.33 U2.6 50.14,15.3 49.77,14.94 49.77,11.65 v49.96,11.46 | 49.8,15.47 50.1,15.33 | v51.75,32 52.26,31.49 v52.26,27.28 | 50.1,15.33 49.91,15.53 v49.35,15.53
  Bottom 0.762: v69.02,52.87 69.11,52.77 69.23,52.77 73.83,48.16 v73.83,44.76 81.2,44.76 83.32,42.64 | v26.44,41.26 21.95,36.78 v21.92,36.78 | v21.92,36.78 | v71.05,43.38 69.07,41.41 v65.41,41.41 | 83.32,42.64 83.39,42.64 JP2.2 | 83.32,42.64 v83.32,42.37
V+1
  Top 0.762: L1.2 C1.2 C13.1 54.34,70.47 RX1.V+
YEL
  Top 0.254: R7.2 60.03,42.8 41.18,42.8 U8.4

### Text on the board
tNames: +12V | GND | SW1 | SW2 | !MCLR | TEST | Tesla | Model S | Camera | Switch | REV | HM LNK | F PWR | R PWR | F CAM | R CAM | V1 - March, 2014 | V1.2 December 2013
Reference: Dimensions 4" x 2.95"